# Altium schematic sheet Roseta_Shield.SchDoc
size A4
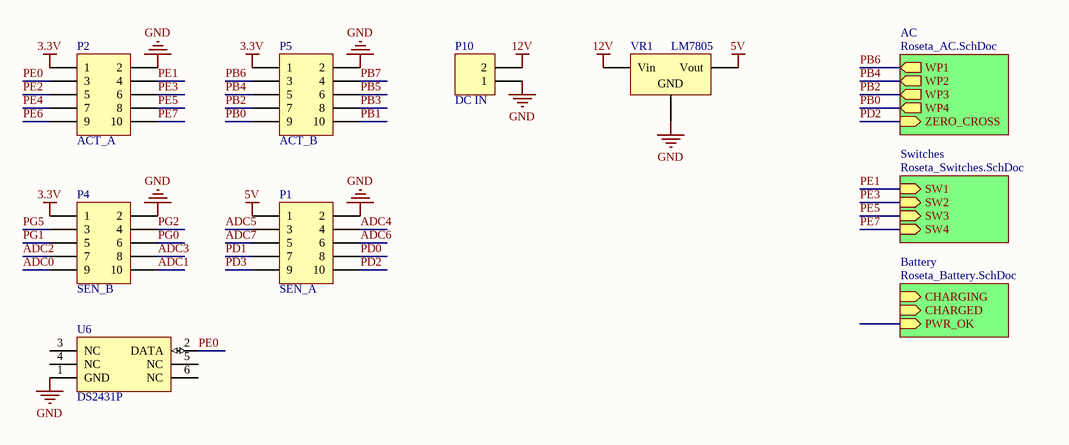
[diagram p0: Roseta_Shield.SchDoc]

## Parts
P1  SEN_A  [HDR2X5_Female_Slim]
P2  ACT_A  [HDR2X5_Female_Slim]
P4  SEN_B  [HDR2X5_Female_Slim]
P5  ACT_B  [HDR2X5_Female_Slim]
P10  DC IN  [TERMINAL BLOCK X2]
U6  DS2431P  [TSOC6]
VR1  LM7805  [TO254P1510-3_4N]

## Sub-sheets
AC = Roseta_AC.SchDoc: WP1 (out), WP2 (out), WP3 (out), WP4 (out), ZERO_CROSS (in)
Battery = Roseta_Battery.SchDoc: PWR_OK (in), CHARGED (in), CHARGING (in)
Switches = Roseta_Switches.SchDoc: SW1 (in), SW2 (in), SW3 (in), SW4 (in)

## Nets
3.3V: P2.1 P4.1 P5.1
5V: P1.1 VR1.3(Vout)
12V: P10.2 VR1.1(Vin)
GND: P1.2 P2.2 P4.2 P5.2 P10.1 U6.1(GND) VR1.2(GND)
ADC0: P4.9
ADC1: P4.10
ADC2: P4.7
ADC3: P4.8
ADC4: P1.4
ADC5: P1.3
ADC6: P1.6
ADC7: P1.5
PB0: P5.9 ; sheet AC/WP4
PB1: P5.10
PB2: P5.7 ; sheet AC/WP3
PB3: P5.8
PB4: P5.5 ; sheet AC/WP2
PB5: P5.6
PB6: P5.3 ; sheet AC/WP1
PB7: P5.4
PD0: P1.8
PD1: P1.7
PD2: P1.10 ; sheet AC/ZERO_CROSS
PD3: P1.9
PE0: P2.3 U6.2(DATA)
PE1: P2.4 ; sheet Switches/SW1
PE2: P2.5
PE3: P2.6 ; sheet Switches/SW2
PE4: P2.7
PE5: P2.8 ; sheet Switches/SW3
PE6: P2.9
PE7: P2.10 ; sheet Switches/SW4
PG0: P4.6
PG1: P4.5
PG2: P4.4
PG5: P4.3

Not connected (* = marked no-connect by the designer): U6 3(NC) 4(NC) 5(NC) 6(NC)

## Library data of the parts
P1 P2 P4 P5 = Header 5X2: Header, 5-Pin, Dual row; LatestRevisionDate: 17-Jul-2002; LatestRevisionNote: Re-released for DXP Platform.; Publisher: Altium Limited
P10 = Header 2: Header, 2-Pin; LatestRevisionDate: 17-Jul-2002; LatestRevisionNote: Re-released for DXP Platform.; Publisher: Altium Limited
U6 = DS2430AP: 256-Bit 1-Wire EEPROM; Note: Pin numbers 3-6 are Not Connected (NC); Published: 13-Oct-2000; LatestRevisionDate: 17-Jul-2002; LatestRevisionNote: Re-released for DXP Platform.; DatasheetVersion: 21-Oct-1999; PackageVersion: 1999; PackageReference: TSOC6; Publisher: Altium Limited; PackageDescription: Small Outline; 6 C-Bend Leads; Body Width 3.8 mm; Pitch 1.27 mm; ComponentLink1Description: Manufacturer Link; ComponentLink1URL: http://www.maxim-ic.com/; ComponentLink2Description: Datasheet; ComponentLink2URL: http://pdfserv.maxim-ic.com/en/ds/DS2430A.pdf
VR1 = Volt Reg: Voltage Regulator; Published: 24-Mar-1999; LatestRevisionDate: 29-May-2009; LatestRevisionNote: IPC-7351 Footprint Added.; PackageReference: D2PAK; Publisher: Altium Limited; PackageDescription: 3-Pin Transistor Outline Package 2.54 mm Pitch, 15.1 mm Lead Span